# Altium schematic sheet stmsheet.SchDoc
size A; SheetNumber: 1; SheetTotal: 8
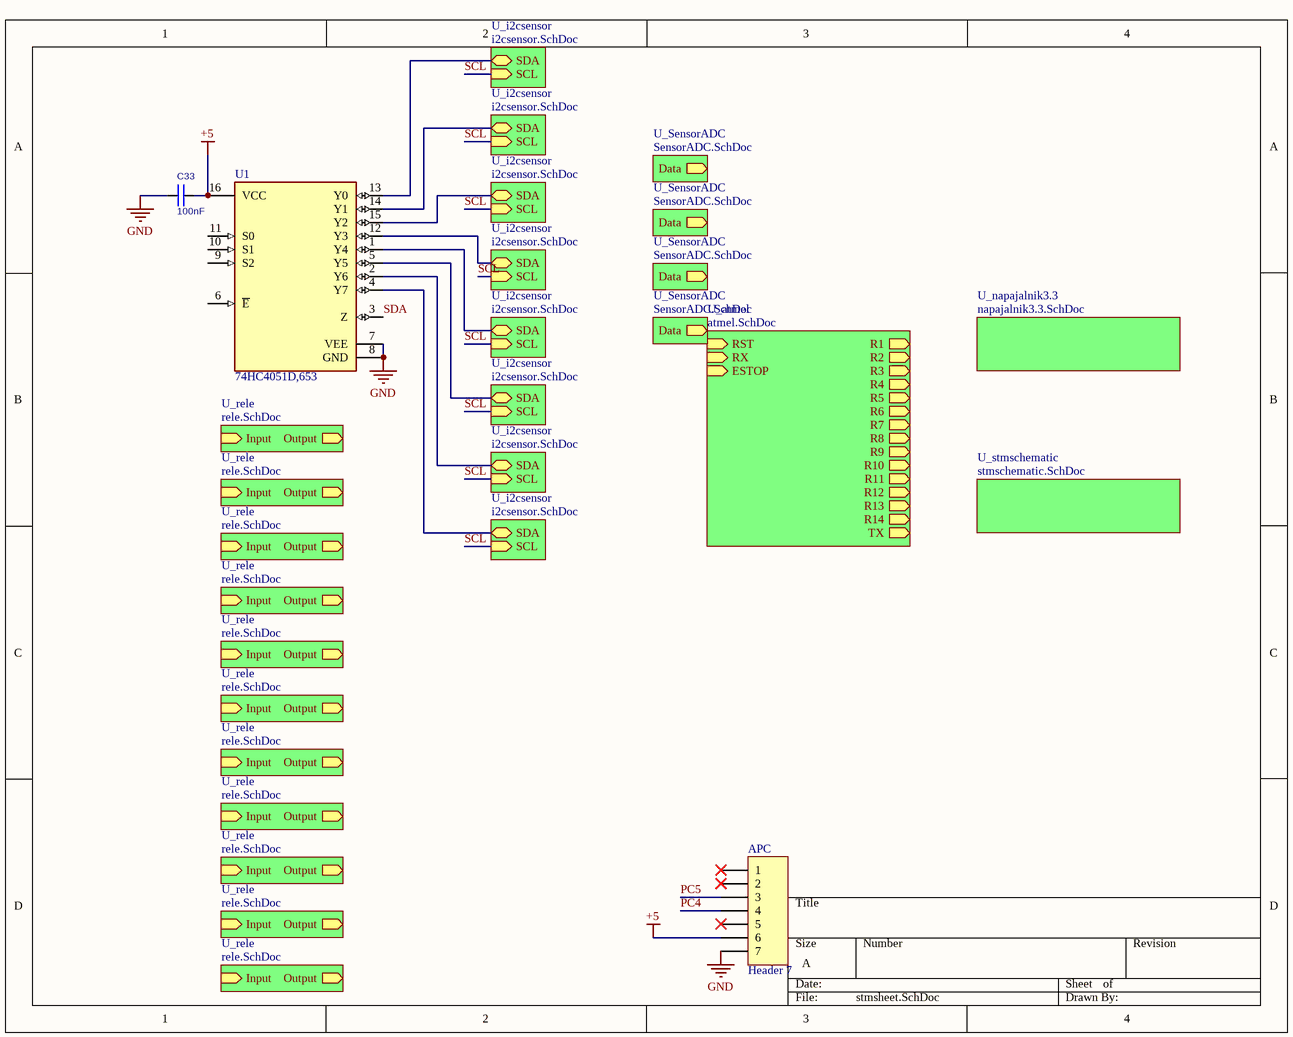
[diagram p0: stmsheet.SchDoc]

## Parts
APC  Header 7  [HDR1X7]
C33  100nF  [C0603]
U1  74HC4051D,653  [FP-SOT109-1-IPC_B]

## Sub-sheets
U_atmel = atmel.SchDoc: RST (in), R6 (out), R4 (out), R5 (out), R8 (out), R2 (out), R3 (out), R1 (out), R7 (out), TX (out), RX (in), ESTOP (in), R9 (out), R10 (out), R11 (out), R12 (out), R13 (out), R14 (out)
U_i2csensor = i2csensor.SchDoc: SDA (bidir), SCL (in)
U_i2csensor = i2csensor.SchDoc: SDA (bidir), SCL (in)
U_i2csensor = i2csensor.SchDoc: SDA (bidir), SCL (in)
U_i2csensor = i2csensor.SchDoc: SDA (bidir), SCL (in)
U_i2csensor = i2csensor.SchDoc: SDA (bidir), SCL (in)
U_i2csensor = i2csensor.SchDoc: SDA (bidir), SCL (in)
U_i2csensor = i2csensor.SchDoc: SDA (bidir), SCL (in)
U_i2csensor = i2csensor.SchDoc: SDA (bidir), SCL (in)
U_napajalnik3.3 = napajalnik3.3.SchDoc: no entries
U_rele = rele.SchDoc: Input (in), Output (out)
U_rele = rele.SchDoc: Input (in), Output (out)
U_rele = rele.SchDoc: Input (in), Output (out)
U_rele = rele.SchDoc: Input (in), Output (out)
U_rele = rele.SchDoc: Input (in), Output (out)
U_rele = rele.SchDoc: Input (in), Output (out)
U_rele = rele.SchDoc: Input (in), Output (out)
U_rele = rele.SchDoc: Input (in), Output (out)
U_rele = rele.SchDoc: Input (in), Output (out)
U_rele = rele.SchDoc: Input (in), Output (out)
U_rele = rele.SchDoc: Input (in), Output (out)
U_SensorADC = SensorADC.SchDoc: Data (out)
U_SensorADC = SensorADC.SchDoc: Data (out)
U_SensorADC = SensorADC.SchDoc: Data (out)
U_SensorADC = SensorADC.SchDoc: Data (out)
U_stmschematic = stmschematic.SchDoc: no entries

## Nets
+5: APC.6 C33.2 U1.16(VCC)
GND: APC.7 C33.1 U1.7(VEE) U1.8(GND)
PC4: APC.4
PC5: APC.3
SCL: sheet U_i2csensor/SCL, sheet U_i2csensor/SCL, sheet U_i2csensor/SCL, sheet U_i2csensor/SCL, sheet U_i2csensor/SCL, sheet U_i2csensor/SCL, sheet U_i2csensor/SCL, sheet U_i2csensor/SCL
SDA: U1.3(Z)
NetU1_1: U1.1(Y4) ; sheet U_i2csensor/SDA
NetU1_2: U1.2(Y6) ; sheet U_i2csensor/SDA
NetU1_4: U1.4(Y7) ; sheet U_i2csensor/SDA
NetU1_5: U1.5(Y5) ; sheet U_i2csensor/SDA
NetU1_12: U1.12(Y3) ; sheet U_i2csensor/SDA
NetU1_13: U1.13(Y0) ; sheet U_i2csensor/SDA
NetU1_14: U1.14(Y1) ; sheet U_i2csensor/SDA
NetU1_15: U1.15(Y2) ; sheet U_i2csensor/SDA

Not connected (* = marked no-connect by the designer): APC 1* 2* 5*; U1 6(~{E}) 9(S2) 10(S1) 11(S0)

## Library data of the parts
APC = Header 7: Header, 7-Pin; LatestRevisionDate: 17-Jul-2002; LatestRevisionNote: Re-released for DXP Platform.; Publisher: Altium Limited
C33 = C: Capacitor; Value: 100nF
U1 = CMP-14339-000003-1: IC MUX/DEMUX 8X1 16SOIC